# EAGLE design RowDriver2 (EAGLE 6.3)
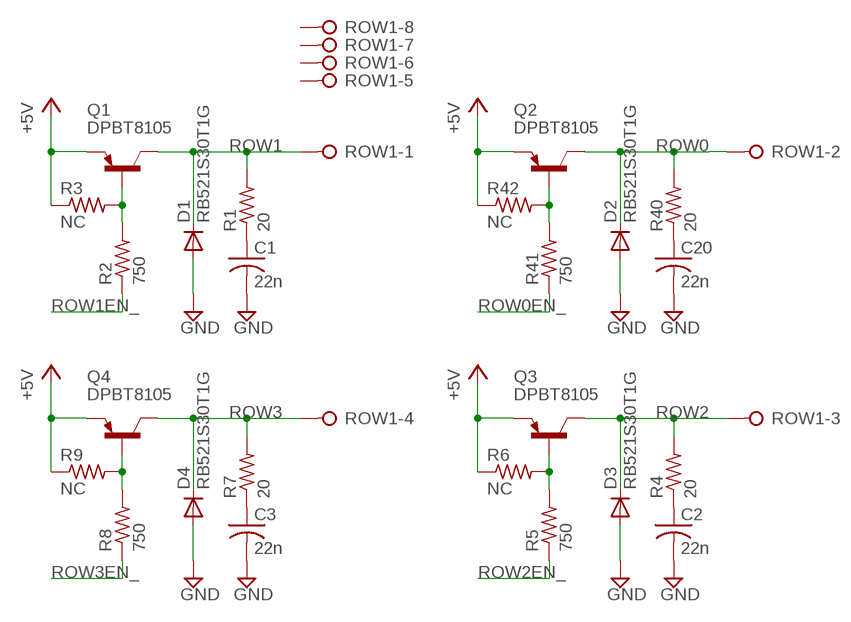
[diagram p0: schematic, sheet 1]

## Parts
C1  22n  C-USC0603  [C0603]
C2  22n  C-USC0603  [C0603]
C3  22n  C-USC0603  [C0603]
C20  22n  C-USC0603  [C0603]
D1  RB521S30T1G  DIODE-SOD523  [SOD523]
D2  RB521S30T1G  DIODE-SOD523  [SOD523]
D3  RB521S30T1G  DIODE-SOD523  [SOD523]
D4  RB521S30T1G  DIODE-SOD523  [SOD523]
Q1  DPBT8105  [SOT23]
Q2  DPBT8105  [SOT23]
Q3  DPBT8105  [SOT23]
Q4  DPBT8105  [SOT23]
R1  20  R-US_R0603  [R0603]
R2  750  R-US_R0603  [R0603]
R3  NC  R-US_R0603  [R0603]
R4  20  R-US_R0603  [R0603]
R5  750  R-US_R0603  [R0603]
R6  NC  R-US_R0603  [R0603]
R7  20  R-US_R0603  [R0603]
R8  750  R-US_R0603  [R0603]
R9  NC  R-US_R0603  [R0603]
R40  20  R-US_R0603  [R0603]
R41  750  R-US_R0603  [R0603]
R42  NC  R-US_R0603  [R0603]
ROW1  OSTVN08A150  [OSTVN08]

## Nets
+5V: Q1.2(E) Q2.2(E) Q3.2(E) Q4.2(E) R3.1 R6.1 R9.1 R42.1
GND: C1.2 C2.2 C3.2 C20.2 D1.A D2.A D3.A D4.A
N$1: Q1.1(B) R2.2 R3.2
N$2: C1.1 R1.1
N$3: Q3.1(B) R5.2 R6.2
N$4: C2.1 R4.1
N$5: Q4.1(B) R8.2 R9.2
N$6: C3.1 R7.1
N$33: Q2.1(B) R41.2 R42.2
N$34: C20.1 R40.1
ROW0: D2.C Q2.3(C) R40.2 ROW1.2
ROW0EN_: R41.1
ROW1: D1.C Q1.3(C) R1.2 ROW1.1
ROW1EN_: R2.1
ROW2: D3.C Q3.3(C) R4.2 ROW1.3
ROW2EN_: R5.1
ROW3: D4.C Q4.3(C) R7.2 ROW1.4
ROW3EN_: R8.1
Unconnected: ROW1.5 ROW1.6 ROW1.7 ROW1.8

## Library data of the parts
C1-C3 C20 = resistor:C-US: CAPACITOR, American symbol
D1-D4 = diode:DIODE-: DIODE
Q1-Q4 = Parts:DPBT8105: DPBT8105 1A PNP SURFACE MOUNT TRANSISTOR
R1-R9 R40-R42 = resistor:R-US_: RESISTOR, American symbol
ROW1 = Parts:OSTVN08A150: OSTVN08A150 0.1" Screw Terminal, 8 Position On Shore Technology, Inc.

## Board
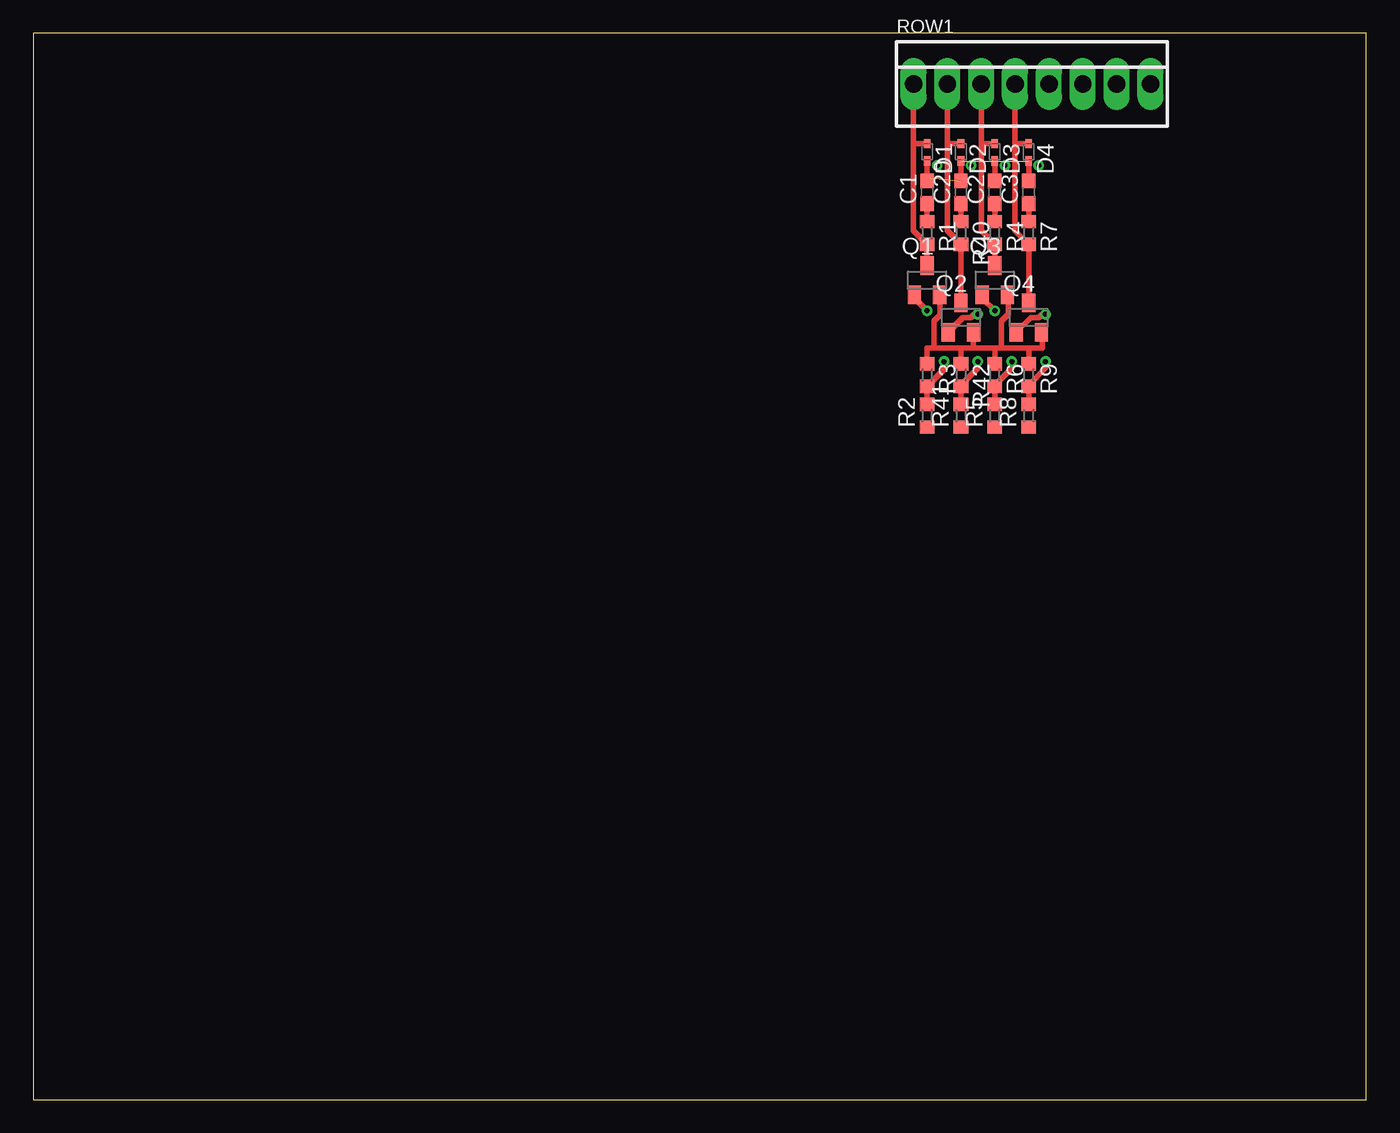
[diagram p1: board, top side]
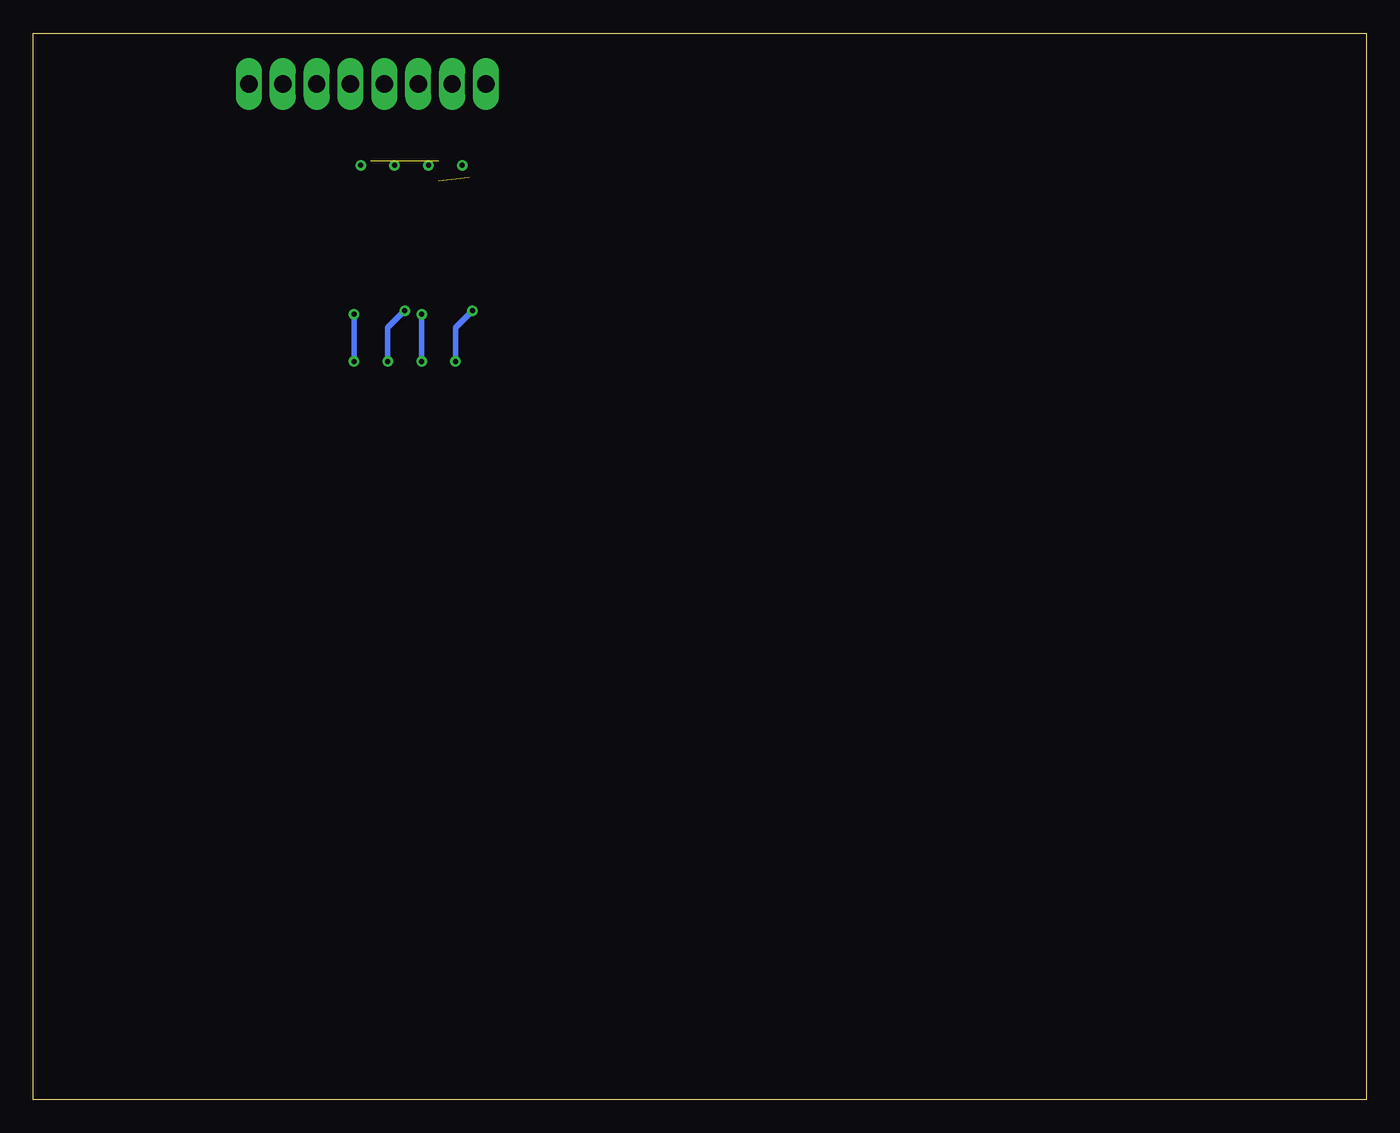
[diagram p2: board, bottom side, seen from below]

Size 100 x 80 mm. Coordinates in mm from the lower left corner, seen from the top.
Outline: 0,0 100,0 100,80 0,80 0,0
Copper layers (1*16): Top 0.035mm / dielectric 1.5mm / Bottom 0.035mm
Design rules "default": minimum track width 10mil, minimum drill 24mil, track to track 8mil, track to pad 8mil, pad to pad 8mil, via to via 8mil, smd to smd 8mil, copper to edge 40mil, drill to drill 8mil, minimum pad ring 10mil, minimum via ring 8mil, stop-mask expansion 4mil, vias tented up to drill 0mil, thermal gap 10mil

### Footprints (pad centres in the part's own frame; a part is rotated, then mirrored left to right if it is on the bottom)
C0603 = smd 1.1 x 1: 1 -0.85,0; 2 0.85,0
SOD523 = smd 0.7 x 0.5: A 0.7,0; C -0.6,0
SOT23 = smd 1 x 1.4: 1 -0.95,-1.1; 2 0.95,-1.1; 3 0,1.1
R0603 = smd 1 x 1.1: 1 -0.85,0; 2 0.85,0
OSTVN08 = drill 1.3 long: 1 -8.89,0; 2 -6.35,0; 3 -3.81,0; 4 -1.27,0; 5 1.27,0; 6 3.81,0; 7 6.35,0; 8 8.89,0

### Placement (x,y rotation side)
C1  67.06,68.07 90 top
C2  72.14,68.07 90 top
C3  74.68,68.07 90 top
C20  69.6,68.07 90 top
D1  67.06,71.12 270 top
D2  69.6,71.12 270 top
D3  72.14,71.12 270 top
D4  74.68,71.12 270 top
Q1  67.06,61.47 0 top
Q2  69.6,58.67 0 top
Q3  72.14,61.47 0 top
Q4  74.68,58.67 0 top
R1  67.06,65.02 270 top
R2  67.06,51.31 90 top
R3  67.06,54.36 270 top
R4  72.14,65.02 270 top
R5  72.14,51.31 90 top
R6  72.14,54.36 270 top
R7  74.68,65.02 270 top
R8  74.68,51.31 90 top
R9  74.68,54.36 270 top
R40  69.6,65.02 270 top
R41  69.6,51.31 90 top
R42  69.6,54.36 270 top
ROW1  74.93,76.2 0 top

### Tracks (layer width: path | path; a pad name or v marks a point on that pad's centre or on a via)
+5V
  Top 0.406: Q1.2 68.01,58.86 67.56,58.42 67.56,56.39 | 67.56,56.39 67.06,56.39 R3.1 | 67.56,56.39 69.6,56.39 | 70.61,56.39 72.14,56.39 | 72.64,56.39 72.64,58.42 73.15,58.93 73.15,60.3 Q3.2 | Q2.2 70.55,56.45 70.61,56.39 | 72.64,56.39 74.68,56.39 | Q4.2 75.69,57.51 75.69,56.39 74.68,56.39 | 70.61,56.39 69.6,56.39 | 69.6,56.39 R42.1 | 72.64,56.39 72.14,56.39 | 72.14,56.39 R6.1 | 74.68,56.39 R9.1
GND  (3 unrouted)
  Top 0.406: D2.A C20.2 | 67.31,69.18 C1.2 D1.A | D3.A C2.2 | D4.A C3.2
N$1  (via drill 0.38)
  Top 0.406: R2.2 R3.2 68.33,54.78 v68.33,55.37 | Q1.1 66.11,60.13 v67.06,59.18
  Bottom 0.406: v67.06,59.18 68.33,57.91 v68.33,55.37
N$2
  Top 0.406: R1.1 C1.1
N$3  (via drill 0.38)
  Top 0.406: R5.2 R6.2 72.14,53.59 73.41,54.86 v73.41,55.37 | Q3.1 71.19,60.13 v72.14,59.18
  Bottom 0.406: v73.41,55.37 73.41,57.91 v72.14,59.18
N$4
  Top 0.406: R4.1 C2.1
N$5  (via drill 0.38)
  Top 0.406: R8.2 R9.2 74.68,53.59 75.95,54.86 v75.95,55.37 | v75.95,58.93 75.69,58.93 75.44,58.67 74.83,58.67 Q4.1
  Bottom 0.406: v75.95,55.37 v75.95,58.93
N$6
  Top 0.406: R7.1 C3.1
N$7  (via drill 0.38)
  other vias: 70.87,58.93
N$8  (via drill 0.38)
  other vias: 72.14,59.18
N$9  (via drill 0.38)
  other vias: 67.06,59.18
N$10  (via drill 0.38)
  other vias: 75.95,58.93
N$11  (via drill 0.38)
  other vias: 68.33,55.37
N$12  (via drill 0.38)
  other vias: 70.87,55.37
N$13  (via drill 0.38)
  other vias: 73.41,55.37
N$14  (via drill 0.38)
  other vias: 75.95,55.37
N$15  (via drill 0.38)
  other vias: 67.82,70.1
N$16  (via drill 0.38)
  other vias: 70.36,70.1
N$17  (via drill 0.38)
  other vias: 72.9,70.1
N$18  (via drill 0.38)
  other vias: 75.44,70.1
N$33  (via drill 0.38)
  Top 0.406: R41.2 R42.2 69.6,53.59 70.87,54.86 v70.87,55.37 | v70.87,58.93 70.61,58.93 70.36,58.67 69.75,58.67 Q2.1
  Bottom 0.406: v70.87,55.37 v70.87,58.93
N$34
  Top 0.406: C20.1 R40.1
ROW0
  Top 0.406: 68.58,71.72 68.58,65.19 R40.2 Q2.3 | D2.C 68.58,71.72 | ROW1.2 68.58,71.72
ROW1
  Top 0.406: ROW1.1 66.04,71.72 | 66.04,71.72 D1.C | 66.04,71.72 66.04,65.19 R1.2 Q1.3
ROW2
  Top 0.406: ROW1.3 71.12,71.72 | 71.12,71.72 71.12,65.19 R4.2 Q3.3 | D3.C 71.12,71.72
ROW3
  Top 0.406: ROW1.4 73.66,71.63 | 73.66,71.63 73.66,65.19 R7.2 Q4.3 | D4.C 73.75,71.72 73.66,71.63